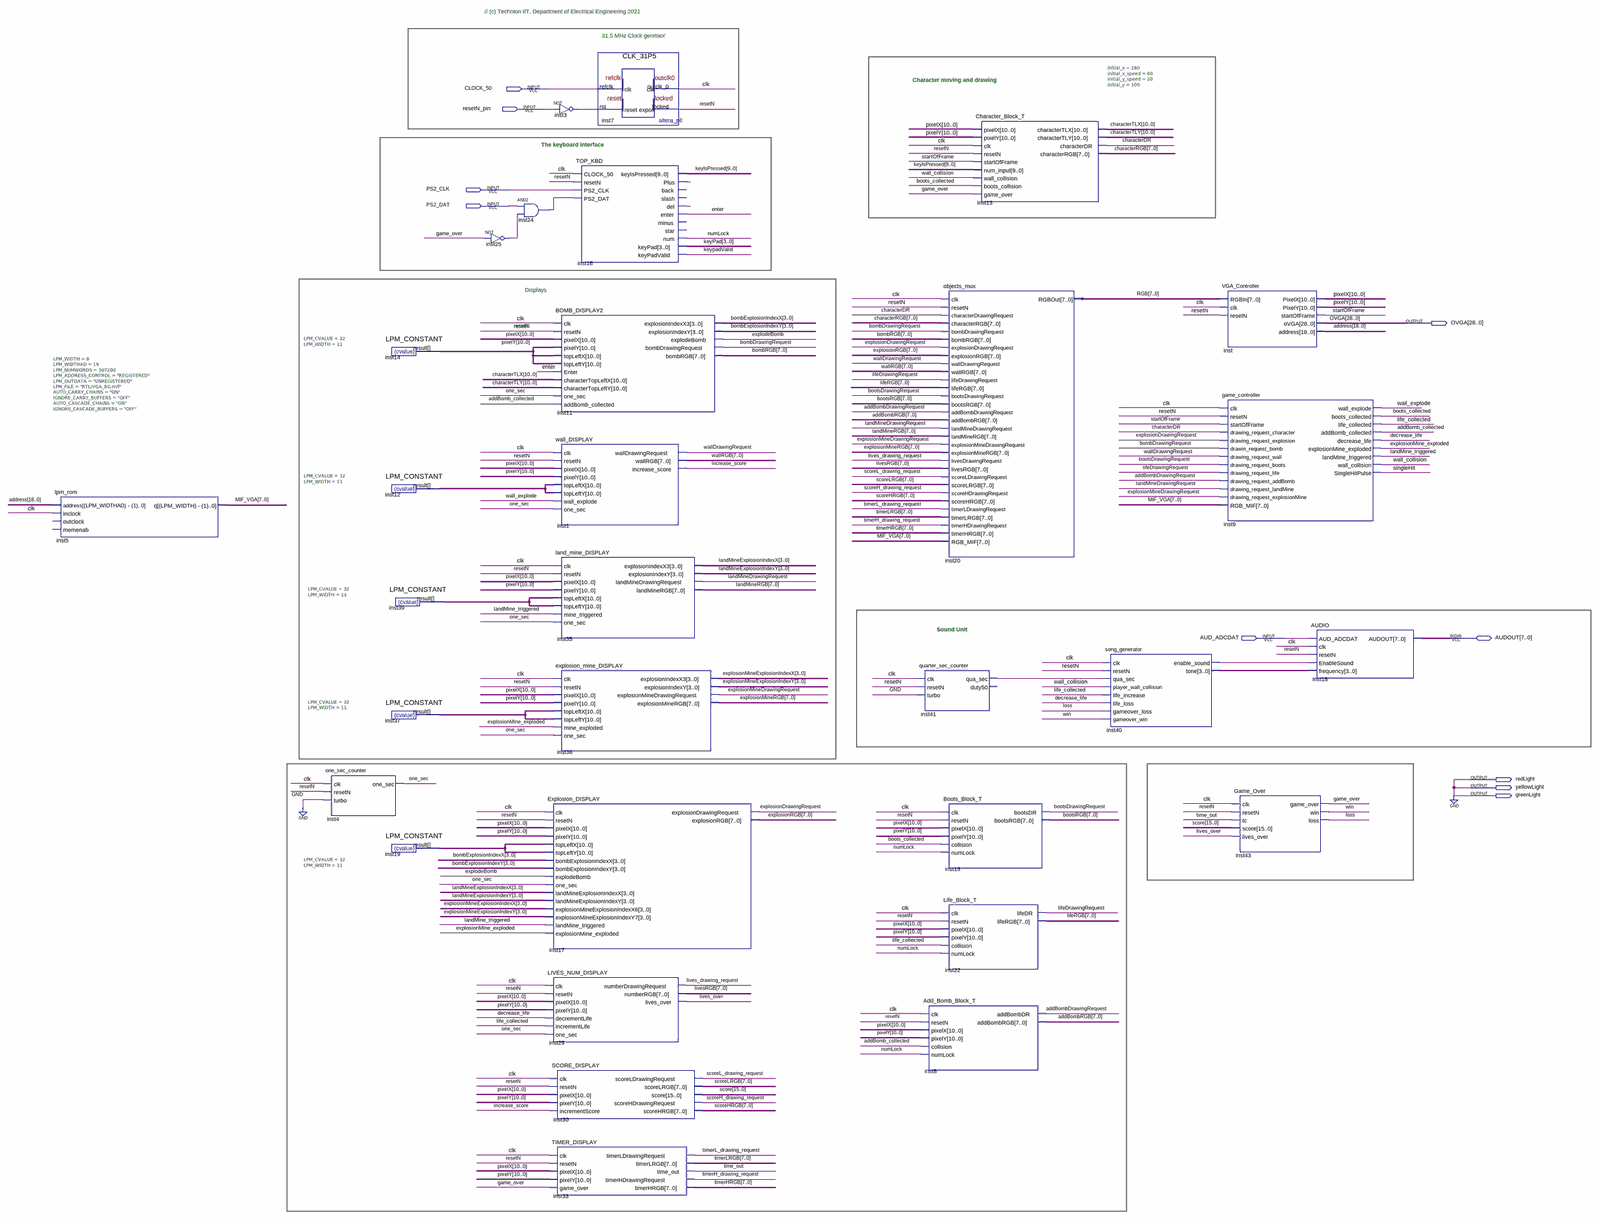
[diagram p0: schematic sheet, whole]
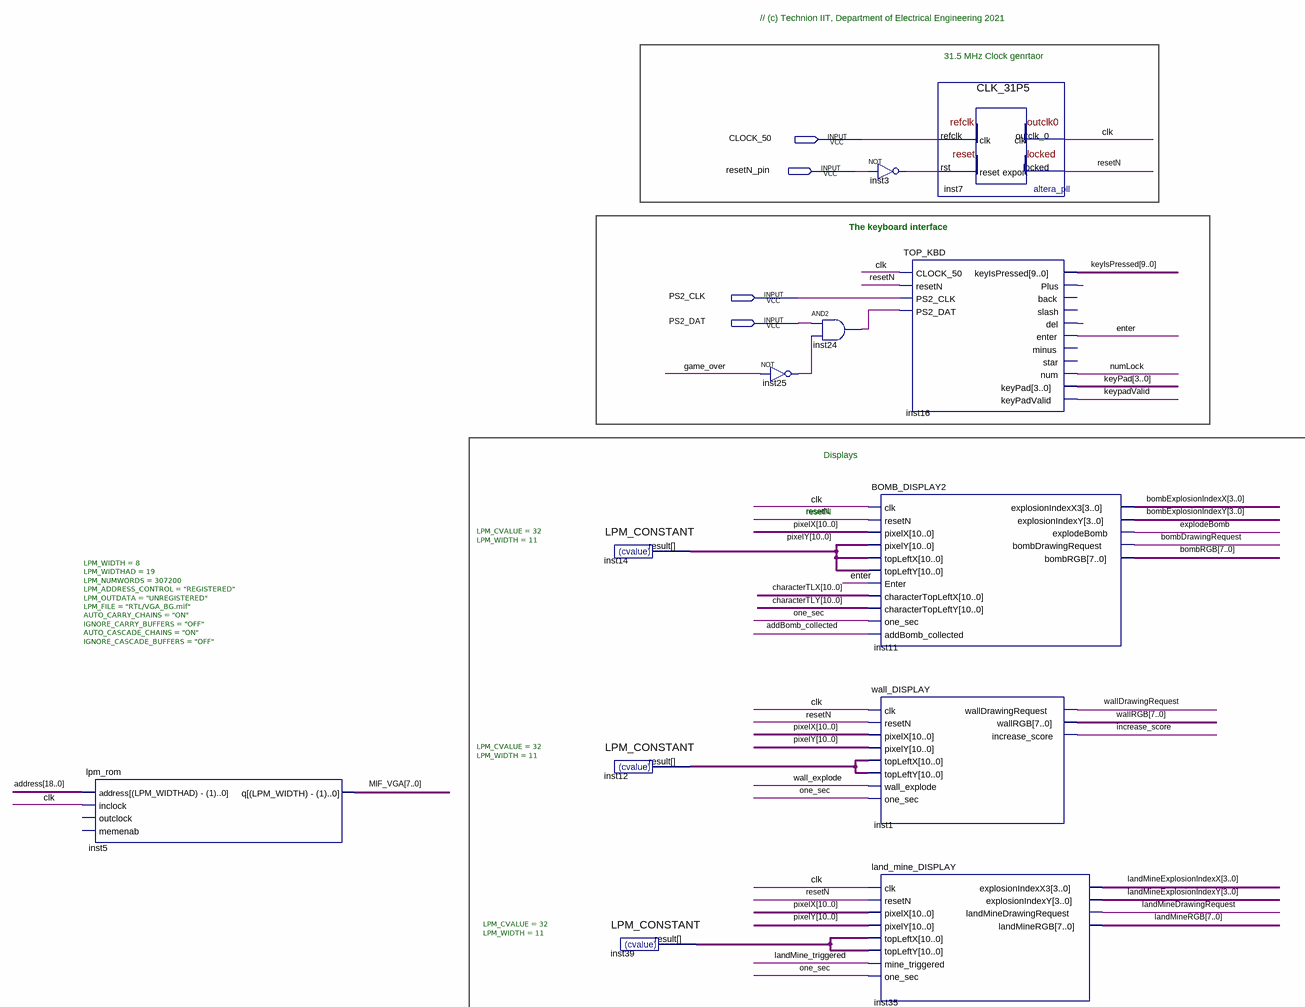
[diagram p1: schematic sheet, upper left part]
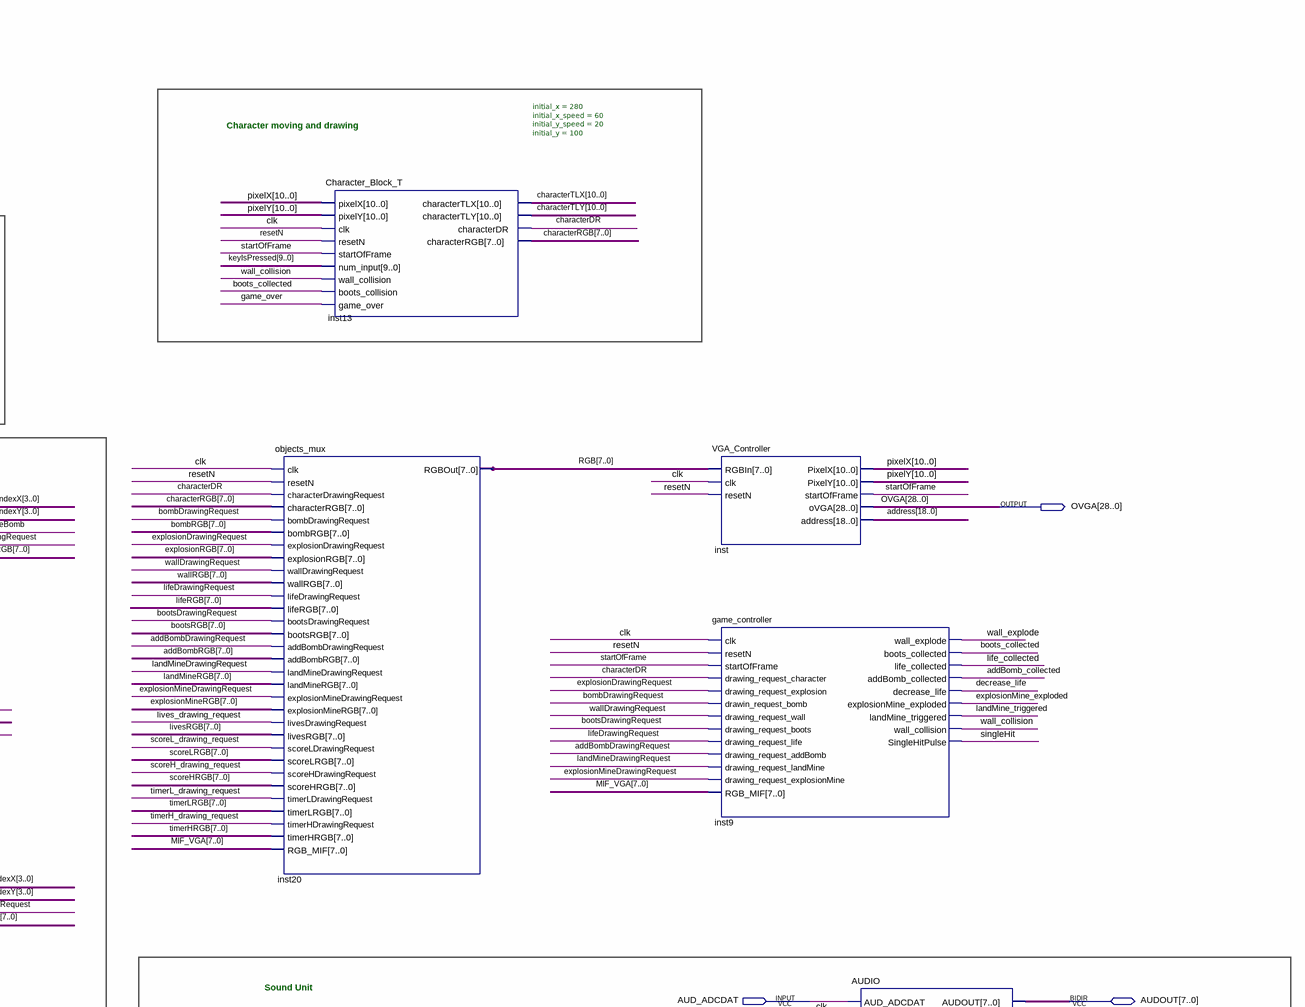
[diagram p2: schematic sheet, upper right part]
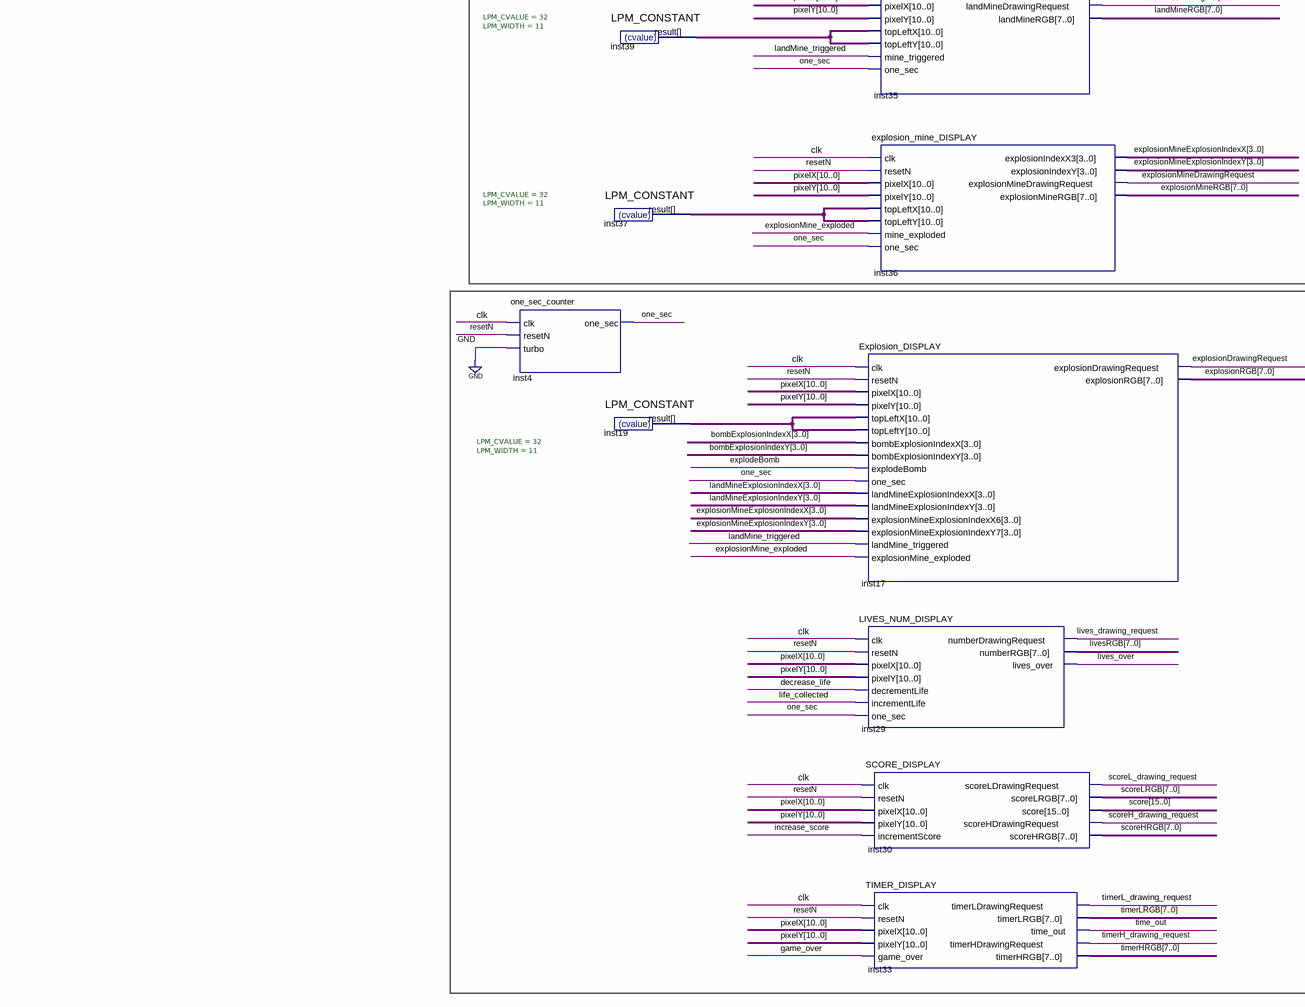
[diagram p3: schematic sheet, lower left part]
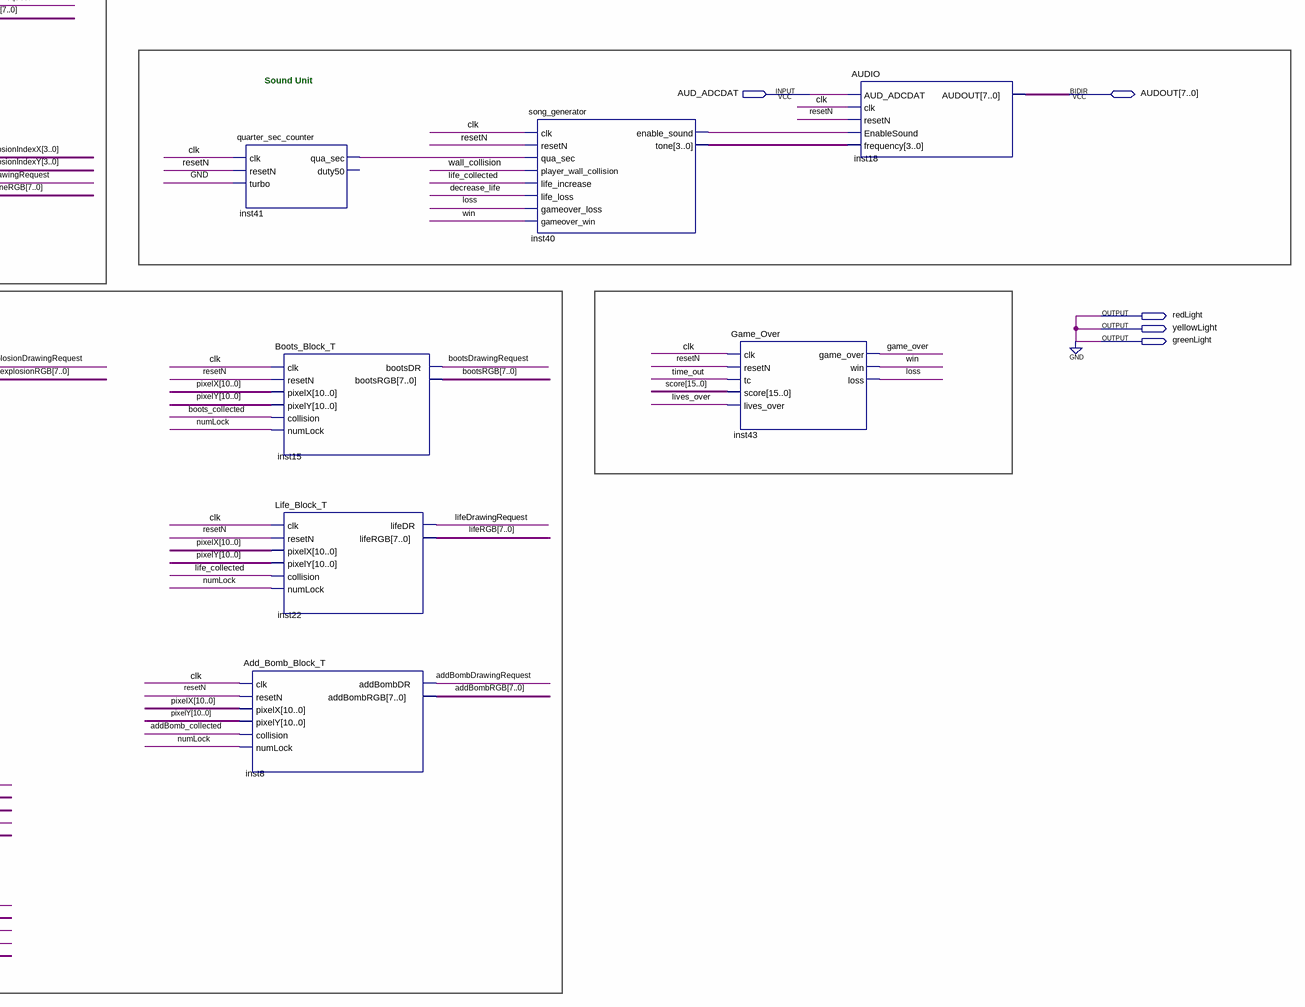
[diagram p4: schematic sheet, lower right part]
// Quartus schematic TOP_VGA_DEMO_KBD_proj.bdf as structural Verilog: 31 symbols, 10 pins
module TOP_VGA_DEMO_KBD_proj (
  input  CLOCK_50,
  input  resetN_pin,
  input  PS2_CLK,
  input  PS2_DAT,
  input  AUD_ADCDAT,
  inout  [7:0] AUDOUT,
  output [28:0] OVGA,
  output redLight,
  output yellowLight,
  output greenLight
);

  wire addBomb_collected, addBombDrawingRequest, bombDrawingRequest, boots_collected, bootsDrawingRequest,
       characterDR, clk, decrease_life, enter, explodeBomb, explosionDrawingRequest, explosionMine_exploded,
       explosionMineDrawingRequest, game_over, increase_score, inst3_out, inst16_del, inst16_plus,
       inst24_out, inst25_out, inst40_enable_sound, inst41_qua_sec, keypadValid, landMine_triggered,
       landMineDrawingRequest, life_collected, lifeDrawingRequest, lives_drawing_request, lives_over, loss,
       numLock, one_sec, resetN, scoreH_drawing_request, scoreL_drawing_request, singleHit, startOfFrame,
       time_out, timerH_drawing_request, timerL_drawing_request, wall_collision, wall_explode,
       wallDrawingRequest, win;
  wire [3:0] bombExplosionIndexX, bombExplosionIndexY, explosionMineExplosionIndexX,
       explosionMineExplosionIndexY, inst40_tone, keyPad, landMineExplosionIndexX, landMineExplosionIndexY;
  wire [7:0] addBombRGB, bombRGB, bootsRGB, characterRGB, explosionMineRGB, explosionRGB, landMineRGB,
       lifeRGB, livesRGB, MIF_VGA, RGB, scoreHRGB, scoreLRGB, timerHRGB, timerLRGB, wallRGB;
  wire [9:0] keyIsPressed;
  wire [10:0] characterTLX, characterTLY, inst12_result, inst19_result, inst37_result, inst39_result, pixelX,
       pixelY;
  wire [15:0] score;
  wire [18:0] address;

  lpm_rom #(.LPM_WIDTH(8), .LPM_WIDTHAD(19), .LPM_NUMWORDS(307200), .LPM_ADDRESS_CONTROL("REGISTERED"), .LPM_OUTDATA("UNREGISTERED"), .LPM_FILE("RTL/VGA_BG.mif"), .AUTO_CARRY_CHAINS("ON"), .IGNORE_CARRY_BUFFERS("OFF"), .AUTO_CASCADE_CHAINS("ON"), .IGNORE_CASCADE_BUFFERS("OFF")) inst5 (
    .address(address), .inclock(clk), .q(MIF_VGA));  // open: outclock, memenab
  one_sec_counter inst4 (.clk(clk), .resetN(resetN), .turbo(1'b0), .one_sec(one_sec));
  LPM_CONSTANT #(.LPM_CVALUE(32), .LPM_WIDTH(11)) inst14 (.result(pixelY));
  LPM_CONSTANT #(.LPM_CVALUE(32), .LPM_WIDTH(11)) inst12 (.result(inst12_result));
  LPM_CONSTANT #(.LPM_CVALUE(32), .LPM_WIDTH(11)) inst37 (.result(inst37_result));
  LPM_CONSTANT #(.LPM_CVALUE(32), .LPM_WIDTH(11)) inst19 (.result(inst19_result));
  LPM_CONSTANT #(.LPM_CVALUE(32), .LPM_WIDTH(11)) inst39 (.result(inst39_result));
  not inst25 (inst25_out, game_over);
  and inst24 (inst24_out, PS2_DAT, inst25_out);
  Explosion_DISPLAY inst17 (
    .clk(clk), .resetN(resetN), .pixelX(pixelX), .pixelY(pixelY), .topLeftX(inst19_result),
    .topLeftY(inst19_result), .bombExplosionIndexX(bombExplosionIndexX),
    .bombExplosionIndexY(bombExplosionIndexY), .explodeBomb(explodeBomb), .one_sec(one_sec),
    .landMineExplosionIndexX(landMineExplosionIndexX), .landMineExplosionIndexY(landMineExplosionIndexY),
    .explosionMineExplosionIndexX6(explosionMineExplosionIndexX),
    .explosionMineExplosionIndexY7(explosionMineExplosionIndexY), .landMine_triggered(landMine_triggered),
    .explosionMine_exploded(explosionMine_exploded), .explosionDrawingRequest(explosionDrawingRequest),
    .explosionRGB(explosionRGB));
  LIVES_NUM_DISPLAY inst29 (
    .clk(clk), .resetN(resetN), .pixelX(pixelX), .pixelY(pixelY), .decrementLife(decrease_life),
    .incrementLife(life_collected), .one_sec(one_sec), .numberDrawingRequest(lives_drawing_request),
    .numberRGB(livesRGB), .lives_over(lives_over));
  not inst3 (inst3_out, resetN_pin);
  TOP_KBD inst16 (
    .CLOCK_50(clk), .resetN(resetN), .PS2_CLK(PS2_CLK), .PS2_DAT(inst24_out), .keyIsPressed(keyIsPressed),
    .Plus(inst16_plus), .del(inst16_del), .enter(enter), .num(numLock), .keyPad(keyPad),
    .keyPadValid(keypadValid));  // open: back, slash, minus, star
  BOMB_DISPLAY2 inst11 (
    .clk(clk), .resetN(resetN), .pixelX(pixelX), .pixelY(pixelY), .topLeftX(pixelY), .topLeftY(pixelY),
    .Enter(enter), .characterTopLeftX(characterTLX), .characterTopLeftY(characterTLY), .one_sec(one_sec),
    .addBomb_collected(addBomb_collected), .explosionIndexX3(bombExplosionIndexX),
    .explosionIndexY(bombExplosionIndexY), .explodeBomb(explodeBomb),
    .bombDrawingRequest(bombDrawingRequest), .bombRGB(bombRGB));
  wall_DISPLAY inst1 (
    .clk(clk), .resetN(resetN), .pixelX(pixelX), .pixelY(pixelY), .topLeftX(inst12_result),
    .topLeftY(inst12_result), .wall_explode(wall_explode), .one_sec(one_sec),
    .wallDrawingRequest(wallDrawingRequest), .wallRGB(wallRGB), .increase_score(increase_score));
  land_mine_DISPLAY inst35 (
    .clk(clk), .resetN(resetN), .pixelX(pixelX), .pixelY(pixelY), .topLeftX(inst39_result),
    .topLeftY(inst39_result), .mine_triggered(landMine_triggered), .one_sec(one_sec),
    .explosionIndexX3(landMineExplosionIndexX), .explosionIndexY(landMineExplosionIndexY),
    .landMineDrawingRequest(landMineDrawingRequest), .landMineRGB(landMineRGB));
  explosion_mine_DISPLAY inst36 (
    .clk(clk), .resetN(resetN), .pixelX(pixelX), .pixelY(pixelY), .topLeftX(inst37_result),
    .topLeftY(inst37_result), .mine_exploded(explosionMine_exploded), .one_sec(one_sec),
    .explosionIndexX3(explosionMineExplosionIndexX), .explosionIndexY(explosionMineExplosionIndexY),
    .explosionMineDrawingRequest(explosionMineDrawingRequest), .explosionMineRGB(explosionMineRGB));
  SCORE_DISPLAY inst30 (
    .clk(clk), .resetN(resetN), .pixelX(pixelX), .pixelY(pixelY), .incrementScore(increase_score),
    .scoreLDrawingRequest(scoreL_drawing_request), .scoreLRGB(scoreLRGB), .score(score),
    .scoreHDrawingRequest(scoreH_drawing_request), .scoreHRGB(scoreHRGB));
  TIMER_DISPLAY inst33 (
    .clk(clk), .resetN(resetN), .pixelX(pixelX), .pixelY(pixelY), .game_over(game_over),
    .timerLDrawingRequest(timerL_drawing_request), .timerLRGB(timerLRGB), .time_out(time_out),
    .timerHDrawingRequest(timerH_drawing_request), .timerHRGB(timerHRGB));
  CLK_31P5 inst7 (.refclk(CLOCK_50), .rst(inst3_out), .outclk_0(clk), .locked(resetN));
  quarter_sec_counter inst41 (.clk(clk), .resetN(resetN), .turbo(1'b0), .qua_sec(inst41_qua_sec));  // open: duty50
  Add_Bomb_Block_T inst8 (
    .clk(clk), .resetN(resetN), .pixelX(pixelX), .pixelY(pixelY), .collision(addBomb_collected),
    .numLock(numLock), .addBombDR(addBombDrawingRequest), .addBombRGB(addBombRGB));
  objects_mux inst20 (
    .clk(clk), .resetN(resetN), .characterDrawingRequest(characterDR), .characterRGB(characterRGB),
    .bombDrawingRequest(bombDrawingRequest), .bombRGB(bombRGB),
    .explosionDrawingRequest(explosionDrawingRequest), .explosionRGB(explosionRGB),
    .wallDrawingRequest(wallDrawingRequest), .wallRGB(wallRGB), .lifeDrawingRequest(lifeDrawingRequest),
    .lifeRGB(lifeRGB), .bootsDrawingRequest(bootsDrawingRequest), .bootsRGB(bootsRGB),
    .addBombDrawingRequest(addBombDrawingRequest), .addBombRGB(addBombRGB),
    .landMineDrawingRequest(landMineDrawingRequest), .landMineRGB(landMineRGB),
    .explosionMineDrawingRequest(explosionMineDrawingRequest), .explosionMineRGB(explosionMineRGB),
    .livesDrawingRequest(lives_drawing_request), .livesRGB(livesRGB),
    .scoreLDrawingRequest(scoreL_drawing_request), .scoreLRGB(scoreLRGB),
    .scoreHDrawingRequest(scoreH_drawing_request), .scoreHRGB(scoreHRGB),
    .timerLDrawingRequest(timerL_drawing_request), .timerLRGB(timerLRGB),
    .timerHDrawingRequest(timerH_drawing_request), .timerHRGB(timerHRGB), .RGB_MIF(MIF_VGA), .RGBOut(RGB));
  Boots_Block_T inst15 (
    .clk(clk), .resetN(resetN), .pixelX(pixelX), .pixelY(pixelY), .collision(boots_collected),
    .numLock(numLock), .bootsDR(bootsDrawingRequest), .bootsRGB(bootsRGB));
  Life_Block_T inst22 (
    .clk(clk), .resetN(resetN), .pixelX(pixelX), .pixelY(pixelY), .collision(life_collected),
    .numLock(numLock), .lifeDR(lifeDrawingRequest), .lifeRGB(lifeRGB));
  Character_Block_T #(.initial_x(280), .initial_x_speed(60), .initial_y_speed(20), .initial_y(100)) inst13 (
    .pixelX(pixelX), .pixelY(pixelY), .clk(clk), .resetN(resetN), .startOfFrame(startOfFrame),
    .num_input(keyIsPressed), .wall_collision(wall_collision), .boots_collision(boots_collected),
    .game_over(game_over), .characterTLX(characterTLX), .characterTLY(characterTLY),
    .characterDR(characterDR), .characterRGB(characterRGB));
  song_generator inst40 (
    .clk(clk), .resetN(resetN), .qua_sec(inst41_qua_sec), .player_wall_collision(wall_collision),
    .life_increase(life_collected), .life_loss(decrease_life), .gameover_loss(loss), .gameover_win(win),
    .enable_sound(inst40_enable_sound), .tone(inst40_tone));
  VGA_Controller inst (
    .RGBIn(RGB), .clk(clk), .resetN(resetN), .PixelX(pixelX), .PixelY(pixelY), .startOfFrame(startOfFrame),
    .oVGA(OVGA), .address(address));
  game_controller inst9 (
    .clk(clk), .resetN(resetN), .startOfFrame(startOfFrame), .drawing_request_character(characterDR),
    .drawing_request_explosion(explosionDrawingRequest), .drawin_request_bomb(bombDrawingRequest),
    .drawing_request_wall(wallDrawingRequest), .drawing_request_boots(bootsDrawingRequest),
    .drawing_request_life(lifeDrawingRequest), .drawing_request_addBomb(addBombDrawingRequest),
    .drawing_request_landMine(landMineDrawingRequest),
    .drawing_request_explosionMine(explosionMineDrawingRequest), .RGB_MIF(MIF_VGA),
    .wall_explode(wall_explode), .boots_collected(boots_collected), .life_collected(life_collected),
    .addBomb_collected(addBomb_collected), .decrease_life(decrease_life),
    .explosionMine_exploded(explosionMine_exploded), .landMine_triggered(landMine_triggered),
    .wall_collision(wall_collision), .SingleHitPulse(singleHit));
  Game_Over inst43 (
    .clk(clk), .resetN(resetN), .tc(time_out), .score(score), .lives_over(lives_over), .game_over(game_over),
    .win(win), .loss(loss));
  AUDIO inst18 (
    .AUD_ADCDAT(AUD_ADCDAT), .clk(clk), .resetN(resetN), .EnableSound(inst40_enable_sound),
    .frequency(inst40_tone), .AUDOUT(AUDOUT));

  assign greenLight = 1'b0;
  assign redLight = 1'b0;
  assign yellowLight = 1'b0;

  // Notes on the sheet:
  //   // (c) Technion IIT, Department of Electrical Engineering 2021
  //   31.5 MHz Clock genrtaor
  //   Character moving and drawing
  //   The keyboard interface
  //   Displays
  //   resetN
  //   Sound Unit
endmodule
